# Altium schematic sheet 23D_RES_Transmitter.SchDoc
size A3
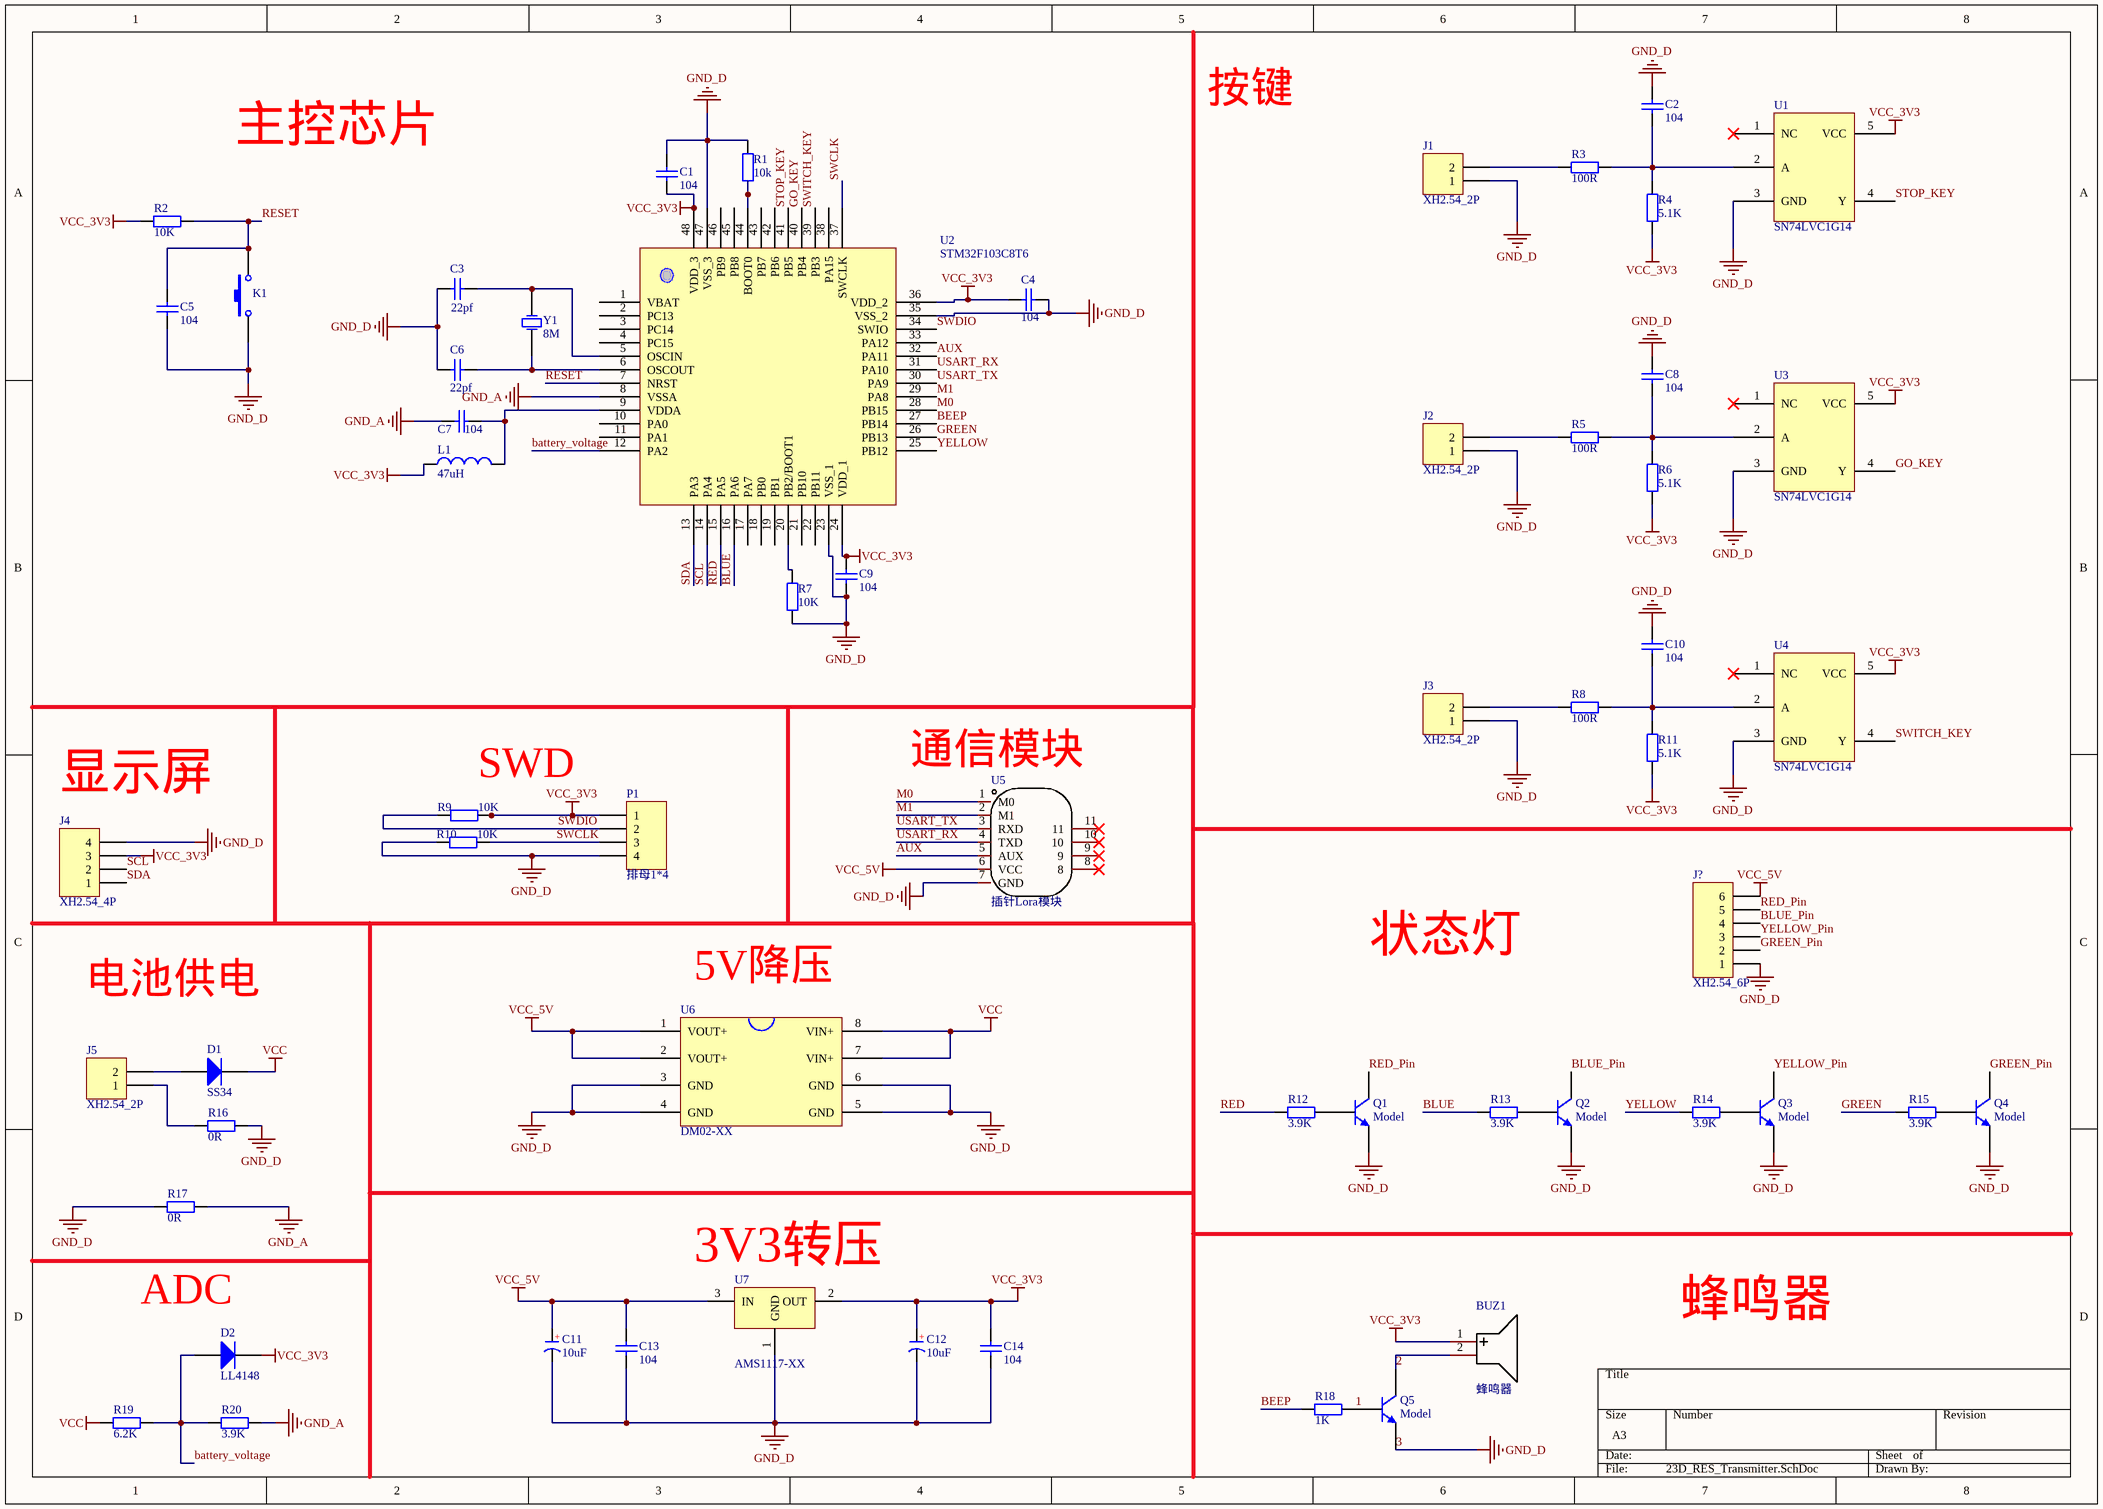
[diagram p0: 23D_RES_Transmitter.SchDoc]

## Parts
BUZ1  蜂鸣器  [BUZ-TH_BD9.0-P5.00-D0.6-FD]
C1  104  [C 0805]
C2  104  [C 0805]
C3  22pf  [C 0805]
C4  104  [C 0805]
C5  104  [C 0805]
C6  22pf  [C 0805]
C7  104  [C 0805]
C8  104  [C 0805]
C9  104  [C 0805]
C10  104  [C 0805]
C11  10uF  [CD B(3528)]
C12  10uF  [CD B(3528)]
C13  104  [C 0805]
C14  104  [C 0805]
D1  SS34  [DO-214]
D2  LL4148  [LL34]
J1  XH2.54_2P  [XH2.54_2P]
J2  XH2.54_2P  [XH2.54_2P]
J3  XH2.54_2P  [XH2.54_2P]
J4  XH2.54_4P  [XH2.54_4P]
J5  XH2.54_2P  [XH2.54_2P]
J?  XH2.54_6P  [XH2.54_6P]
K1  Key  [KEY 3.6*2.5 SMD]  (value not drawn)
L1  47uH  [L 0805]
P1  排母1*4  [HDR2.54-M-LI-4P]
Q1  Model  [SOT23-3]
Q2  Model  [SOT23-3]
Q3  Model  [SOT23-3]
Q4  Model  [SOT23-3]
Q5  Model  [SOT23-3]
R1  10k  [R 0805]
R2  10K  [R 0805]
R3  100R  [R 0805]
R4  5.1K  [R 0805]
R5  100R  [R 0805]
R6  5.1K  [R 0805]
R7  10K  [R 0805]
R8  100R  [R 0805]
R9  10K  [R 0805]
R10  10K  [R 0805]
R11  5.1K  [R 0805]
R12  3.9K  [R 0805]
R13  3.9K  [R 0805]
R14  3.9K  [R 0805]
R15  3.9K  [R 0805]
R16  0R  [R 0805]
R17  0R  [R 0805]
R18  1K  [R 0805]
R19  6.2K  [R 0805]
R20  3.9K  [R 0805]
U1  SN74LVC1G14  [SOT23-5]
U2  STM32F103C8T6  [LQFP48]
U3  SN74LVC1G14  [SOT23-5]
U4  SN74LVC1G14  [SOT23-5]
U5  Name: 插针Lora模块  [WIRELM-TH_E32-TTL-1W]  (hidden comment: E32-433T30D)
U6  DM02-XX  [DM02]
U7  AMS1117-XX  [SOT223]
Y1  8M  [XTAL-5032]

## Nets
3: C1.2 C2.1 C3.2 C4.1 C5.1 C6.1 C8.1 C9.1 C10.1 C11.2(K) C12.2(K) C13.2 C14.2 J1.1 J2.1 J3.1 J4.4 J?.1 K1.1 P1.4 Q1.2(E) Q2.2(E) Q3.2(E) Q4.2(E) Q5.2(E) R1.2 R7.1 R10.2 R16.2 R17.1 U1.3(GND) U2.23(VSS_1) U2.35(VSS_2) U2.47(VSS_3) U3.3(GND) U4.3(GND) U5.7(GND) U6.3(GND) U6.4(GND) U6.5(GND) U6.6(GND) U7.1(GND)  [also labelled GND_D]
GND_A: C7.2 R17.2 R20.2 U2.8(VSSA)
VCC: D1.2(K) R19.1 U6.7(VIN+) U6.8(VIN+)
VCC_3V3: BUZ1.1(+) C1.1 C4.2 C9.2 C12.1(A) C14.1 D2.2(K) J4.3 L1.1 P1.1 R2.1 R4.2 R6.2 R9.1 R11.2 U1.5(VCC) U2.24(VDD_1) U2.36(VDD_2) U2.48(VDD_3) U3.5(VCC) U4.5(VCC) U7.2(OUT)
VCC_5V: C11.1(A) C13.1 J?.6 U5.6(VCC) U6.1(VOUT+) U6.2(VOUT+) U7.3(IN)
1: Q5.1(B) R18.2
2: BUZ1.2(-) Q5.3(C)
AUX: U2.32(PA11) U5.5(AUX)
battery_voltage: D2.1(A) R19.2 R20.1 U2.12(PA2)
BEEP: R18.1 U2.27(PB14)
BLUE: R13.1 U2.16(PA6)
BLUE_Pin: J?.4 Q2.3(C)
GO_KEY: U2.40(PB4) U3.4(Y)
GREEN: R15.1 U2.26(PB13)
GREEN_Pin: J?.2 Q4.3(C)
M0: U2.28(PB15) U5.1(M0)
M1: U2.29(PA8) U5.2(M1)
RED: R12.1 U2.15(PA5)
RED_Pin: J?.5 Q1.3(C)
RESET: C5.2 K1.2 R2.2 U2.7(NRST)
SCL: J4.2 U2.14(PA4)
SDA: J4.1 U2.13(PA3)
STOP_KEY: U1.4(Y) U2.41(PB5)
SWCLK: P1.3 R10.1 U2.37(SWCLK)
SWDIO: P1.2 R9.2 U2.34(SWIO)
SWITCH_KEY: U2.39(PB3) U4.4(Y)
USART_RX: U2.31(PA10) U5.4(TXD)
USART_TX: U2.30(PA9) U5.3(RXD)
YELLOW: R14.1 U2.25(PB12)
YELLOW_Pin: J?.3 Q3.3(C)
NetC2_2: C2.2 R3.1 R4.1 U1.2(A)
NetC3_1: C3.1 U2.5(OSCIN) Y1.2(OSC2)
NetC6_2: C6.2 U2.6(OSCOUT) Y1.1(OSC1)
NetC7_1: C7.1 L1.2 U2.9(VDDA)
NetC8_2: C8.2 R5.1 R6.1 U3.2(A)
NetC10_2: C10.2 R8.1 R11.1 U4.2(A)
NetD1_1: D1.1(A) J5.2
NetJ1_2: J1.2 R3.2
NetJ2_2: J2.2 R5.2
NetJ3_2: J3.2 R8.2
NetJ5_1: J5.1 R16.1
NetQ1_1: Q1.1(B) R12.2
NetQ2_1: Q2.1(B) R13.2
NetQ3_1: Q3.1(B) R14.2
NetQ4_1: Q4.1(B) R15.2
NetR1_1: R1.1 U2.44(BOOT0)
NetR7_2: R7.2 U2.20(PB2/BOOT1)

Not connected (* = marked no-connect by the designer): U1 1(NC)*; U2 1(VBAT) 2(PC13) 3(PC14) 4(PC15) 10(PA0) 11(PA1) 17(PA7) 18(PB0) 19(PB1) 21(PB10) 22(PB11) 33(PA12) 38(PA15) 42(PB6) 43(PB7) 45(PB8) 46(PB9); U3 1(NC)*; U4 1(NC)*; U5 8* 9* 10* 11*

## Notes on the sheet
- 按键
- 主控芯片
- (near R9) SWD
- (near U5) 通信模块
- (near J4) 显示屏
- (near U6) 5V降压
- 状态灯
- 电池供电
- ADC
- (near U7) 3V3转压
- 蜂鸣器
- (in symbol 贴片钽电容) +

## Library data of the parts
BUZ1 = 蜂鸣器: Add into BOM: yes; Symbol: 蜂鸣器; Device: 蜂鸣器; LCSC Part Name: 蜂鸣器; Supplier Part: C9900020875; Manufacturer Part: 蜂鸣器; Supplier Footprint: 插件; JLCPCB Part Class: 扩展库; Supplier: LCSC; Convert to PCB: yes; Name: 蜂鸣器
C1-C10 C13 C14 = Cap: 无极性电容
C11 C12 = 贴片钽电容
D1 D2 = Diode: 二极管
K1 = Key: 按键
L1 = Inductor: 电感
Q1-Q5 = Transistor_NPN: NPN三极管
R1-R20 = Resistor: 电阻
U1 U3 U4 = SN74LVC1G14: 单路施密特反相器
U2 = STM32F103C8T6: Micro controller
U5 = E32-433T30D: SX1278方案Lora扩频433M无线串口模块/1W/UART; Manufacturer: EBYTE(亿佰特); Symbol: E32-TTL-1W; Add into BOM: yes; Device: E32-433T30D; LCSC Part Name: 33M无线串口模块 SX1278方案Lora扩频4 UART 1W; Supplier Part: C97351; Manufacturer Part: E32-433T30D; Supplier Footprint: 插件; JLCPCB Part Class: 扩展库; Datasheet: https://atta.szlcsc.com/upload/public/pdf/source/20170306/1488794692664.pdf; Supplier: LCSC; Convert to PCB: yes
U6 = DM02: 开关型DC-DC变换器
U7 = AMS1117: 线性稳压器
Y1 = XTAL: 晶振